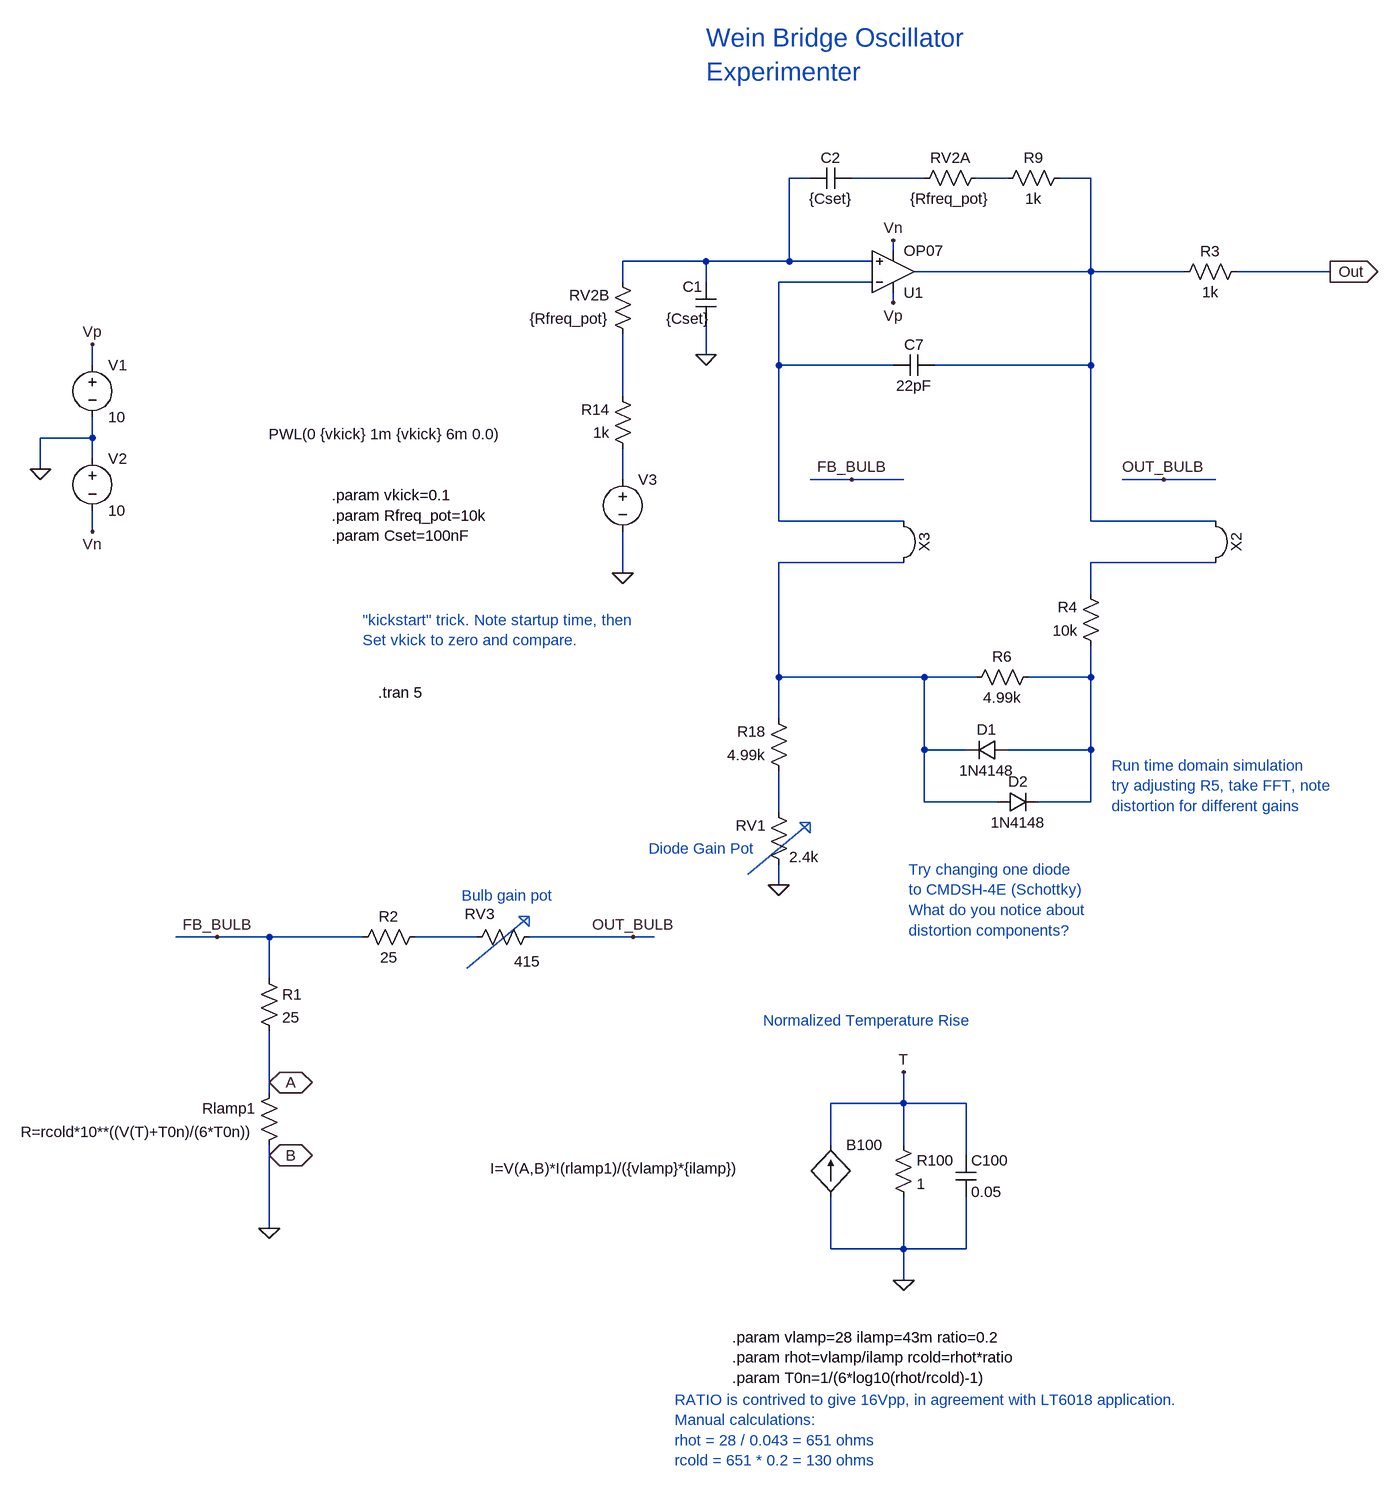
[diagram p0: schematic wien_bridge_osc_experimenter.asc]
wien_bridge_osc_experimenter.asc, the LTspice schematic file:
Version 4
SHEET 1 1888 2076
WIRE 128 96 96 96
WIRE 304 96 192 96
WIRE 432 96 384 96
WIRE 560 96 512 96
WIRE 256 208 256 192
WIRE -32 224 -160 224
WIRE 96 224 96 96
WIRE 96 224 -32 224
WIRE 224 224 96 224
WIRE 560 240 560 96
WIRE 560 240 288 240
WIRE 704 240 560 240
WIRE 928 240 784 240
WIRE -160 256 -160 224
WIRE -32 256 -32 224
WIRE 224 256 80 256
WIRE 256 288 256 272
WIRE -32 368 -32 320
WIRE -976 384 -976 352
WIRE 80 384 80 256
WIRE 256 384 80 384
WIRE 560 384 560 240
WIRE 560 384 320 384
WIRE -160 432 -160 336
WIRE -976 496 -976 464
WIRE -976 496 -1056 496
WIRE -976 528 -976 496
WIRE -1056 544 -1056 496
WIRE -160 560 -160 512
WIRE 192 560 128 560
WIRE 272 560 192 560
WIRE 672 560 608 560
WIRE 752 560 672 560
WIRE 80 624 80 384
WIRE 272 624 80 624
WIRE 560 624 560 384
WIRE 752 624 560 624
WIRE -976 640 -976 608
WIRE 272 688 80 688
WIRE 752 688 560 688
WIRE -160 704 -160 640
WIRE 560 736 560 688
WIRE 80 864 80 688
WIRE 304 864 80 864
WIRE 384 864 304 864
WIRE 560 864 560 816
WIRE 560 864 464 864
WIRE 80 928 80 864
WIRE 304 976 304 864
WIRE 368 976 304 976
WIRE 560 976 560 864
WIRE 560 976 432 976
WIRE 304 1056 304 976
WIRE 416 1056 304 1056
WIRE 560 1056 560 976
WIRE 560 1056 480 1056
WIRE 80 1072 80 1008
WIRE 80 1184 80 1152
WIRE -784 1264 -848 1264
WIRE -704 1264 -784 1264
WIRE -560 1264 -704 1264
WIRE -384 1264 -480 1264
WIRE -144 1264 -304 1264
WIRE -112 1264 -144 1264
WIRE -704 1328 -704 1264
WIRE -704 1488 -704 1408
WIRE -704 1504 -704 1488
WIRE 272 1520 272 1472
WIRE 272 1520 160 1520
WIRE 368 1520 272 1520
WIRE 160 1584 160 1520
WIRE 272 1584 272 1520
WIRE -704 1600 -704 1584
WIRE 368 1600 368 1520
WIRE -704 1712 -704 1600
WIRE 160 1744 160 1664
WIRE 272 1744 272 1664
WIRE 272 1744 160 1744
WIRE 368 1744 368 1664
WIRE 368 1744 272 1744
WIRE 272 1792 272 1744
FLAG -1056 544 0
FLAG -976 352 Vp
FLAG 256 288 Vp
FLAG -976 640 Vn
FLAG 256 192 Vn
FLAG -32 368 0
FLAG -160 704 0
FLAG 80 1184 0
FLAG 928 240 Out
IOPIN 928 240 Out
FLAG 272 1472 T
FLAG 272 1792 0
FLAG -704 1488 A
IOPIN -704 1488 BiDir
FLAG -704 1600 B
IOPIN -704 1600 BiDir
FLAG -704 1712 0
FLAG 672 560 OUT_BULB
FLAG 192 560 FB_BULB
FLAG -784 1264 FB_BULB
FLAG -144 1264 OUT_BULB
SYMBOL Opamps\\OP07 256 304 M180
SYMATTR InstName U1
SYMBOL voltage -976 368 R0
WINDOW 123 0 0 Left 0
WINDOW 39 0 0 Left 0
SYMATTR InstName V1
SYMATTR Value 10
SYMBOL voltage -976 512 R0
WINDOW 123 0 0 Left 0
WINDOW 39 0 0 Left 0
SYMATTR InstName V2
SYMATTR Value 10
SYMBOL res 400 80 R90
WINDOW 0 0 56 VBottom 2
WINDOW 3 32 56 VTop 2
SYMATTR InstName RV2A
SYMATTR Value {Rfreq_pot}
SYMBOL res 480 848 R90
WINDOW 0 0 56 VBottom 2
WINDOW 3 32 56 VTop 2
SYMATTR InstName R6
SYMATTR Value 4.99k
SYMBOL res 576 832 R180
WINDOW 0 36 76 Left 2
WINDOW 3 36 40 Left 2
SYMATTR InstName R4
SYMATTR Value 10k
SYMBOL res 96 1168 R180
WINDOW 0 36 76 Left 2
WINDOW 3 -46 27 Left 2
SYMATTR InstName RV1
SYMATTR Value 2.4k
SYMBOL res 96 1024 R180
WINDOW 0 36 76 Left 2
WINDOW 3 36 40 Left 2
SYMATTR InstName R18
SYMATTR Value 4.99k
SYMBOL cap 192 80 R90
WINDOW 0 0 32 VBottom 2
WINDOW 3 32 32 VTop 2
SYMATTR InstName C2
SYMATTR Value {Cset}
SYMBOL cap -48 320 M180
WINDOW 0 -20 57 Left 2
WINDOW 3 -45 8 Left 2
SYMATTR InstName C1
SYMATTR Value {Cset}
SYMBOL res -144 352 R180
WINDOW 0 36 76 Left 2
WINDOW 3 36 40 Left 2
SYMATTR InstName RV2B
SYMATTR Value {Rfreq_pot}
SYMBOL diode 432 960 R90
WINDOW 0 0 32 VBottom 2
WINDOW 3 32 32 VTop 2
SYMATTR InstName D1
SYMATTR Value 1N4148
SYMBOL diode 416 1072 R270
WINDOW 0 32 32 VTop 2
WINDOW 3 0 32 VBottom 2
SYMATTR InstName D2
SYMATTR Value 1N4148
SYMBOL voltage -160 544 R0
WINDOW 3 -545 -54 Left 2
WINDOW 123 0 0 Left 0
WINDOW 39 0 0 Left 0
SYMATTR Value PWL(0 {vkick} 1m {vkick} 6m 0.0)
SYMATTR InstName V3
SYMBOL res 528 80 R90
WINDOW 0 0 56 VBottom 2
WINDOW 3 32 56 VTop 2
SYMATTR InstName R9
SYMATTR Value 1k
SYMBOL res 800 224 R90
WINDOW 0 0 56 VBottom 2
WINDOW 3 32 56 VTop 2
SYMATTR InstName R3
SYMATTR Value 1k
SYMBOL res -144 528 R180
WINDOW 0 36 76 Left 2
WINDOW 3 36 40 Left 2
SYMATTR InstName R14
SYMATTR Value 1k
SYMBOL bi2 160 1584 R0
WINDOW 3 -524 36 Left 2
SYMATTR Value I=V(A,B)*I(rlamp1)/({vlamp}*{ilamp})
SYMATTR InstName B100
SYMBOL res 256 1568 R0
SYMATTR InstName R100
SYMATTR Value 1
SYMBOL cap 352 1600 R0
SYMATTR InstName C100
SYMATTR Value 0.05
SYMBOL res -688 1488 M0
SYMATTR InstName Rlamp1
SYMATTR Value R=rcold*10**((V(T)+T0n)/(6*T0n))
SYMBOL res -720 1312 R0
SYMATTR InstName R1
SYMATTR Value 25
SYMBOL Misc\\jumper 816 656 R90
SYMATTR InstName X2
SYMBOL cap 320 368 R90
WINDOW 0 0 32 VBottom 2
WINDOW 3 32 32 VTop 2
SYMATTR InstName C7
SYMATTR Value 22pF
SYMBOL Misc\\jumper 336 656 R90
SYMATTR InstName X3
SYMBOL res -464 1248 R90
WINDOW 0 0 56 VBottom 2
WINDOW 3 32 56 VTop 2
SYMATTR InstName R2
SYMATTR Value 25
SYMBOL res -400 1280 R270
WINDOW 0 36 20 VTop 2
WINDOW 3 -6 93 VBottom 2
SYMATTR InstName RV3
SYMATTR Value 415
TEXT -536 888 Left 2 !.tran 5
TEXT -560 776 Left 2 ;"kickstart" trick. Note startup time, then\nSet vkick to zero and compare.
TEXT -608 584 Left 2 !.param vkick=0.1\n.param Rfreq_pot=10k\n.param Cset=100nF
TEXT -32 -120 Left 4 ;Wein Bridge Oscillator\nExperimenter
TEXT 592 1000 Left 2 ;Run time domain simulation\ntry adjusting R5, take FFT, note\ndistortion for different gains
TEXT 56 1392 Left 2 ;Normalized Temperature Rise
TEXT 8 1880 Left 2 !.param vlamp=28 ilamp=43m ratio=0.2\n.param rhot=vlamp/ilamp rcold=rhot*ratio\n.param T0n=1/(6*log10(rhot/rcold)-1)
TEXT -80 1976 Left 2 ;RATIO is contrived to give 16Vpp, in agreement with LT6018 application.\nManual calculations:\nrhot = 28 / 0.043 = 651 ohms\nrcold = 651 * 0.2 = 130 ohms
TEXT 280 1160 Left 2 ;Try changing one diode\nto CMDSH-4E (Schottky)\nWhat do you notice about\ndistortion components?
TEXT -120 1128 Left 2 ;Diode Gain Pot
TEXT -408 1200 Left 2 ;Bulb gain pot
LINE Normal -304 1232 -400 1312
LINE Normal -304 1248 -304 1232
LINE Normal -320 1232 -304 1248
LINE Normal -304 1232 -320 1232
LINE Normal 128 1104 128 1088
LINE Normal 112 1088 128 1104
LINE Normal 128 1088 112 1088
LINE Normal 128 1088 32 1168

The netlist it stands for:
* wien_bridge_osc_experimenter.asc
XU1 N001 N005 Vp Vn N004 LT1001  ; OP07, pins In+ In- V+ V- OUT
V1 Vp 0 10
V2 0 Vn 10
RV2A N003 N002 {Rfreq_pot}
R6 N008 N005 4.99k
R4 N008 N004 10k
RV1 0 N009 2.4k
R18 N009 N005 4.99k
C2 N002 N001 {Cset}
C1 0 N001 {Cset}
RV2B N006 N001 {Rfreq_pot}
D1 N008 N005 1N4148
D2 N005 N008 1N4148
V3 N007 0 PWL(0 {vkick} 1m {vkick} 6m 0.0)
R9 N004 N003 1k
R3 Out N004 1k
R14 N007 N006 1k
B100 0 T I=V(A,B)*I(rlamp1)/({vlamp}*{ilamp})
R100 T 0 1
C100 T 0 0.05
Rlamp1 A 0 R=rcold*10**((V(T)+T0n)/(6*T0n))
R1 FB_BULB A 25
C7 N004 N005 22pF
R2 N010 FB_BULB 25
RV3 N010 OUT_BULB 415
.model D D
.lib standard.dio
.tran 5
* "kickstart" trick. Note startup time, then
* Set vkick to zero and compare.
.param vkick=0.1
.param Rfreq_pot=10k
.param Cset=100nF
* Wein Bridge Oscillator
* Experimenter
* Run time domain simulation
* try adjusting R5, take FFT, note
* distortion for different gains
* Normalized Temperature Rise
.param vlamp=28 ilamp=43m ratio=0.2
.param rhot=vlamp/ilamp rcold=rhot*ratio
.param T0n=1/(6*log10(rhot/rcold)-1)
* RATIO is contrived to give 16Vpp, in agreement with LT6018 application.
* Manual calculations:
* rhot = 28 / 0.043 = 651 ohms
* rcold = 651 * 0.2 = 130 ohms
* Try changing one diode
* to CMDSH-4E (Schottky)
* What do you notice about
* distortion components?
* Diode Gain Pot
* Bulb gain pot
.lib LTC.lib
.backanno
.end